# Altium project Mini1_diseno1.PrjPcb
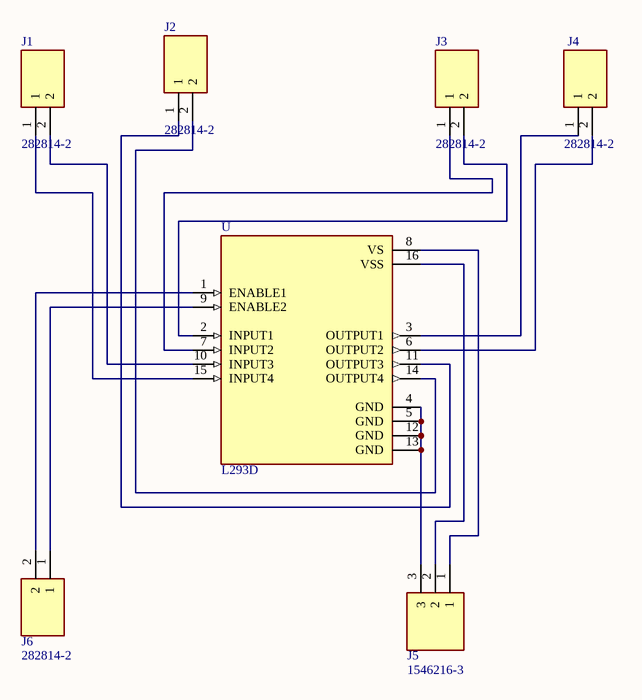
[diagram p0: puenteh.SchDoc]
1 sheet, 7 parts. Net scope: global (net labels, ports and power ports of the same name join across sheets).
Board file: PCB1.PcbDoc

## Sheet puenteh.SchDoc
size A

### Parts
J1  282814-2  [TE_282814-2]
J2  282814-2  [TE_282814-2]
J3  282814-2  [TE_282814-2]
J4  282814-2  [TE_282814-2]
J5  1546216-3  [TE_1546216-3]
J6  282814-2  [TE_282814-2]
U  L293D  [DIP880W50P254L2000H510Q16]

### Nets
NetJ1_1: J1.1 U.15(INPUT4)
NetJ1_2: J1.2 U.10(INPUT3)
NetJ2_1: J2.1 U.11(OUTPUT3)
NetJ2_2: J2.2 U.14(OUTPUT4)
NetJ3_1: J3.1 U.7(INPUT2)
NetJ3_2: J3.2 U.2(INPUT1)
NetJ4_1: J4.1 U.3(OUTPUT1)
NetJ4_2: J4.2 U.6(OUTPUT2)
NetJ5_1: J5.1 U.8(VS)
NetJ5_2: J5.2 U.16(VSS)
NetJ5_3: J5.3 U.4(GND) U.5(GND) U.12(GND) U.13(GND)
NetJ6_1: J6.1 U.9(ENABLE2)
NetJ6_2: J6.2 U.1(ENABLE1)

### Library data of the parts
J1-J4 J6 = 282814-2: TERMINAL BLOCK,HEADER, 5.08 MM, 2WAY; Product Range:-; Gender:Header; MF: TE Connectivity; EU_RoHS_Compliance: Compliant; SnapEDA_Link: https://www.snapeda.com/parts/282814-2/TE%20Connectivity%20AMP%20Connectors/view-part/2381383/?ref=snap; Availability: Unavailable; Price: None; Package: None; TE_purchase_URL: https://www.te.com/usa-en/product-282814-2.html?te_bu=Cor&te_type=disp&te_campaign=seda_glo_cor-seda-global-disp-prtnr-fy19-seda-model-bom-cta_sma-317_1&elqCampaignId=32493; MP: 282814-2; Value: *
J5 = 1546216-3: 3 Position Wire to Board Terminal Block Horizontal with Board 0.197 _5.00mm_ Through Hole; MF: TE Connectivity; Value: *; MP: 1546216-3; SnapEDA_Link: https://www.snapeda.com/parts/1546216-3/TE%20Connectivity%20AMP%20Connectors/view-part/2881592/?ref=snap; Availability: Unavailable; Package: None; TE_purchase_URL: https://www.te.com/usa-en/product-1546216-3.html?te_bu=Cor&te_type=disp&te_campaign=seda_glo_cor-seda-global-disp-prtnr-fy19-seda-model-bom-cta_sma-317_1&elqCampaignId=32493; Price: None
U = L293D: Bipolar Motor Driver Parallel 16-PowerDIP; MF: STMicroelectronics; Availability: Unavailable; SnapEDA_Link: https://www.snapeda.com/parts/L293D/STMicroelectronics/view-part/83726/?ref=snap; MP: L293D; Price: None; Package: SOIC-20 STMicroelectronics; Value: *